# Altium project BMS_Master.PrjPcb
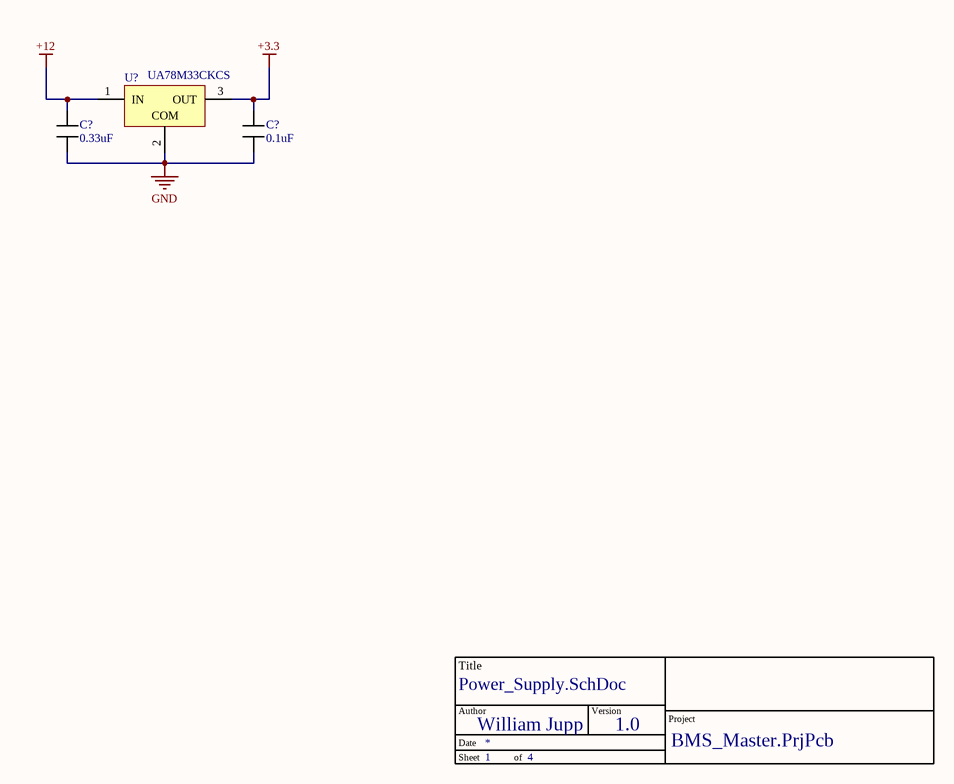
[diagram p0: Power_Supply.SchDoc]
Version: 1.0; ProAuthor: William Jupp
4 sheets, 7 parts. Net scope: global (net labels, ports and power ports of the same name join across sheets).
Sheets:
  Power_Supply.SchDoc
  ADC.SchDoc
  MCU.SchDoc
  CAN.SchDoc

## Sheet Power_Supply.SchDoc
size A4; SheetNumber: 1; SheetTotal: 4

### Parts
(Parts that share a designator on the sheet are numbered #1, #2 ... from top to bottom, then left to right.)
?#1  Title_Block  (value not drawn)
C?#1  0.33uF  [C_0603]
C?#2  value 0.1uF  [C_0603]  (hidden comment: C)
U?  UA78M33CKCS  [KCS0003A]

### Nets
+3.3: C?#2.2 U?.3(OUT)
+12: C?#1.2 U?.1(IN)
GND: C?#1.1 C?#2.1 U?.2(COM)

### Notes on the sheet
- (in symbol Title_Block) Title; Author; Version; Project; Date; Sheet; of

### Library data of the parts
C?#1 C?#2 = Capacitor: ComponentLink1Description: New link; ComponentLink1URL: *
  C?#1: Value: 0.33uF
U? = CMP-0324-00055-2: Regulator with 5.3 to 25 V Input and 3.3 V Output, 0 to 125 degC, 3-Pin TO-220 (KCS), Pb-Free (RoHS); Manufacturer: Texas Instruments; Vin(Max)(V): 25; Vout(Max)(V): 3.3; Iout(Max)(A): 0.5; Vin(Min)(V): 5.3; Iq(Typ)(mA): 6; PackageVersion: revC, Oct-2001; DatasheetVersion: SLVS059Q; PartNumber: UA78M33CKCS; Eco-Plan: Pb-Free (RoHS); ComponentLink1Description: Datasheet; Vout(Min)(V): 3.3; PackageReference: KCS0003A; ComponentLink1URL: http://www.ti.com/general/docs/lit/getliterature.tsp?genericPartNumber=UA78M33&fileType=pdf; Code_JEDEC: TO-226-AA; Mounting Technology: Through Hole; ComponentLink2Description: URL Link1; ComponentLink2URL: Samples URL:http://www.ti.com/product/ua78m33#samples; PackageDescription: Plastic Cylindrical Package, Formed Lead Option (TO-92)

## Sheet ADC.SchDoc
size A4; SheetNumber: 2; SheetTotal: 4
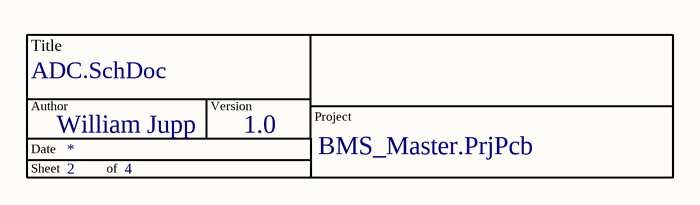
[diagram p1: ADC.SchDoc]

### Parts
(Parts that share a designator on the sheet are numbered #1, #2 ... from top to bottom, then left to right.)
?#2  Title_Block  (value not drawn)

### Notes on the sheet
- (in symbol Title_Block) Title; Author; Version; Project; Date; Sheet; of

## Sheet MCU.SchDoc
size A4; SheetNumber: 3; SheetTotal: 4
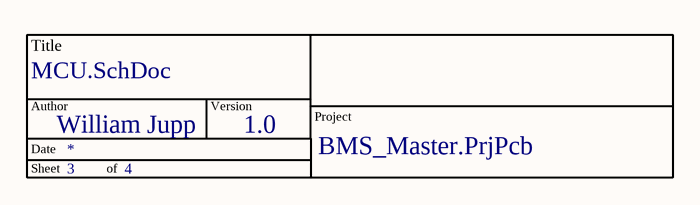
[diagram p2: MCU.SchDoc]

### Parts
(Parts that share a designator on the sheet are numbered #1, #2 ... from top to bottom, then left to right.)
?#3  Title_Block  (value not drawn)

### Notes on the sheet
- (in symbol Title_Block) Title; Author; Version; Project; Date; Sheet; of

## Sheet CAN.SchDoc
size A4; SheetNumber: 4; SheetTotal: 4
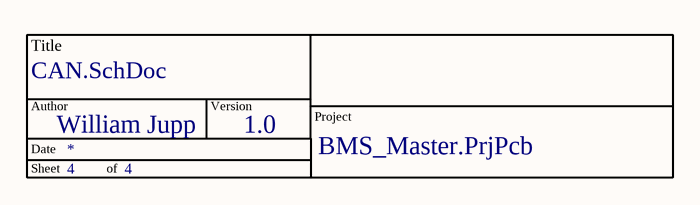
[diagram p3: CAN.SchDoc]

### Parts
(Parts that share a designator on the sheet are numbered #1, #2 ... from top to bottom, then left to right.)
?#4  Title_Block  (value not drawn)

### Notes on the sheet
- (in symbol Title_Block) Title; Author; Version; Project; Date; Sheet; of